# Altium schematic sheet RelèBluetooth.SchDoc
size A4; SheetNumber: 1; SheetTotal: 1
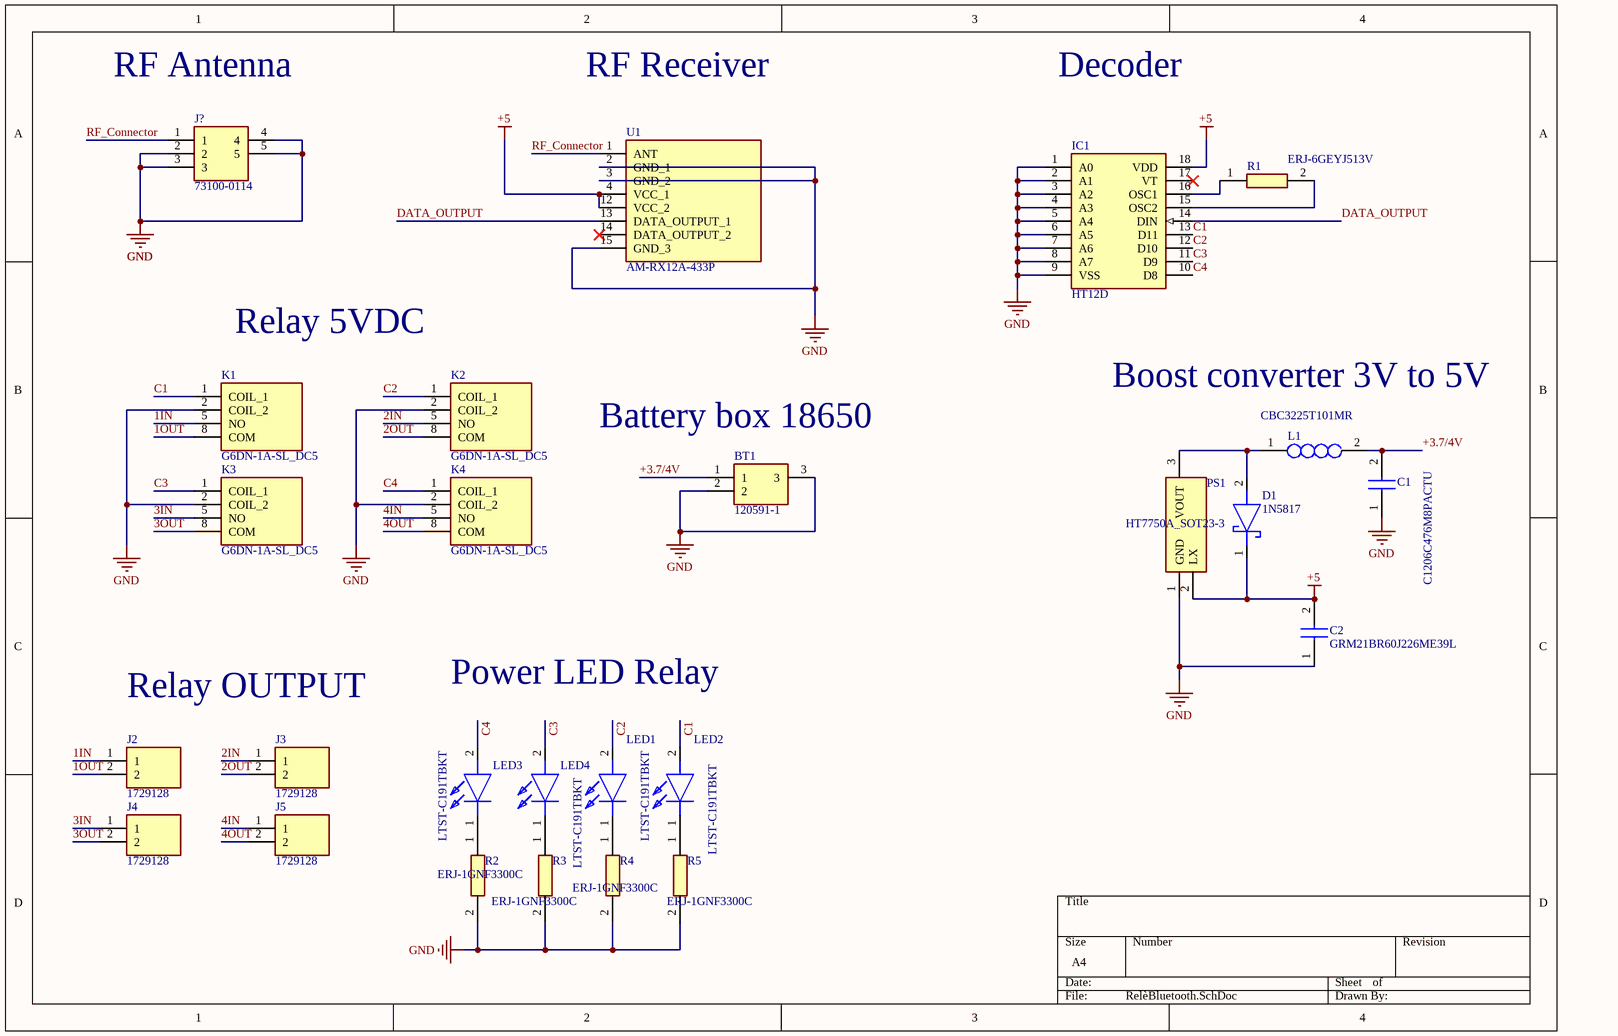
[diagram p0: RelèBluetooth.SchDoc]

## Parts
BT1  120591-1  [120591-1]
C1  C1206C476M8PACTU  [C1206]
C2  GRM21BR60J226ME39L  [CAPC2012X145N]
D1  1N5817  [DIOAD1410W90L470D235]
IC1  HT12D  [DIP794W56P254L2286H495Q18N]
J2  1729128  [1729128]
J3  1729128  [1729128]
J4  1729128  [1729128]
J5  1729128  [1729128]
J?  73100-0114  [731000114]
K1  G6DN-1A-SL_DC5  [G6DN1ASLDC5]
K2  G6DN-1A-SL_DC5  [G6DN1ASLDC5]
K3  G6DN-1A-SL_DC5  [G6DN1ASLDC5]
K4  G6DN-1A-SL_DC5  [G6DN1ASLDC5]
L1  CBC3225T101MR  [INDC3225X270N]
LED1  LTST-C191TBKT  [LEDC1608X65N]
LED2  LTST-C191TBKT  [LEDC1608X65N]
LED3  LTST-C191TBKT  [LEDC1608X65N]
LED4  LTST-C191TBKT  [LEDC1608X65N]
PS1  HT7750A_SOT23-3  [SOT95P190X145-3N]
R1  ERJ-6GEYJ513V  [RESC2012X70N]
R2  ERJ-1GNF3300C  [ERJ1GN_(0201)]
R3  ERJ-1GNF3300C  [ERJ1GN_(0201)]
R4  ERJ-1GNF3300C  [ERJ1GN_(0201)]
R5  ERJ-1GNF3300C  [ERJ1GN_(0201)]
U1  AM-RX12A-433P  [AMRX12A433P]

## Nets
+5: C2.2 D1.1(K) IC1.18(VDD) PS1.2(LX) U1.4(VCC_1) U1.12(VCC_2)
GND: BT1.2 BT1.3 C1.1 C2.1 IC1.1(A0) IC1.2(A1) IC1.3(A2) IC1.4(A3) IC1.5(A4) IC1.6(A5) IC1.7(A6) IC1.8(A7) IC1.9(VSS) J?.2 J?.3 J?.4 J?.5 K1.2(COIL_2) K2.2(COIL_2) K3.2(COIL_2) K4.2(COIL_2) PS1.1(GND) R2.2 R3.2 R4.2 R5.2 U1.2(GND_1) U1.3(GND_2) U1.15(GND_3)
1IN: J2.1 K1.5(NO)
1OUT: J2.2 K1.8(COM)
2IN: J3.1 K2.5(NO)
2OUT: J3.2 K2.8(COM)
3IN: J4.1 K3.5(NO)
3OUT: J4.2 K3.8(COM)
4IN: J5.1 K4.5(NO)
4OUT: J5.2 K4.8(COM)
+3.7/4V: BT1.1 C1.2 L1.2
C1: IC1.13(D11) K1.1(COIL_1) LED2.2(A)
C2: IC1.12(D10) K2.1(COIL_1) LED1.2(A)
C3: IC1.11(D9) K3.1(COIL_1) LED4.2(A)
C4: IC1.10(D8) K4.1(COIL_1) LED3.2(A)
DATA_OUTPUT: IC1.14(DIN) U1.13(DATA_OUTPUT_1)
RF_Connector: J?.1 U1.1(ANT)
NetD1_2: D1.2(A) L1.1 PS1.3(VOUT)
NetIC1_15: IC1.15(OSC2) R1.2
NetIC1_16: IC1.16(OSC1) R1.1
NetLED1_1: LED1.1(K) R4.1
NetLED2_1: LED2.1(K) R5.1
NetLED3_1: LED3.1(K) R2.1
NetLED4_1: LED4.1(K) R3.1

Not connected (* = marked no-connect by the designer): IC1 17(VT)*; U1 14(DATA_OUTPUT_2)*

## Notes on the sheet
- RF Antenna
- RF Receiver
- Decoder
- Relay 5VDC
- (near BT1) Battery box 18650
- Boost converter 3V to 5V
- Relay OUTPUT
- Power LED Relay

## Library data of the parts
BT1 = 120591-1: Battery; Manufacturer_Name: TE Connectivity; Datasheet Link: http://www.te.com/commerce/DocumentDelivery/DDEController?Action=srchrtrv&DocNm=120591&DocType=Customer+Drawing&DocLang=English&DocFormat=pdf&PartCntxt=120591-1; Manufacturer_Part_Number: 120591-1; Mouser Part Number: 571-1205911; Mouser Price/Stock: https://www.mouser.co.uk/ProductDetail/TE-Connectivity/120591-1?qs=cB%252BprIo57OeZ1n1mnEiYEw%3D%3D; Arrow Part Number: 120591-1; Arrow Price/Stock: https://www.arrow.com/en/products/120591-1/te-connectivity?region=nac
C1 = C1206C476M8PACTU: Capacitor; Manufacturer_Name: KEMET; Datasheet Link: https://content.kemet.com/datasheets/KEM_C1006_X5R_SMD.pdf; Manufacturer_Part_Number: C1206C476M8PACTU; Mouser Part Number: 80-C1206C476M8P; Mouser Price/Stock: https://www.mouser.co.uk/ProductDetail/KEMET/C1206C476M8PACTU?qs=K%2Fj%2Fqf%252B0fqIWQ8LQ8mLiKw%3D%3D; Arrow Part Number: C1206C476M8PACTU; Arrow Price/Stock: https://www.arrow.com/en/products/c1206c476m8pactu/kemet-corporation
C2 = GRM21BR60J226ME39L: Capacitor; Manufacturer_Name: Murata Electronics; Datasheet Link: http://www.murata.com/~/media/webrenewal/support/library/catalog/products/capacitor/mlcc/c02e.pdf; Height: 1.45mm; Manufacturer_Part_Number: GRM21BR60J226ME39L; Mouser Part Number: 81-GRM21R60J226ME39L; Mouser Price/Stock: https://www.mouser.co.uk/ProductDetail/Murata-Electronics/GRM21BR60J226ME39L?qs=DJY02EClX9n4vY1%2FNV53Qw%3D%3D; Arrow Part Number: GRM21BR60J226ME39L; Arrow Price/Stock: https://www.arrow.com/en/products/grm21br60j226me39l/murata-manufacturing?region=nac
D1 = 1N5817: Schottky Diode; Manufacturer_Name: Rectron; Datasheet Link: https://www.arrow.com/en/products/1n5817/rectron; Manufacturer_Part_Number: 1N5817; Arrow Part Number: 1N5817; Arrow Price/Stock: https://www.arrow.com/en/products/1n5817/rectron?region=nac
IC1 = HT12D: Integrated Circuit; Manufacturer_Name: Holtek; Datasheet Link: https://datasheet.datasheetarchive.com/originals/distributors/Datasheets-28/DSA-559636.pdf; Height: 4.953mm; Manufacturer_Part_Number: HT12D
J2-J5 = 1729128: Connector; Manufacturer_Name: Phoenix Contact; Datasheet Link: http://www.phoenixcontact.net/product/1729128; Height: 10.15mm; Manufacturer_Part_Number: 1729128; Mouser Part Number: 651-1729128; Mouser Price/Stock: https://www.mouser.co.uk/ProductDetail/Phoenix-Contact/1729128?qs=GFUSqQMLmmnCBVBY3dts9w%3D%3D; Arrow Part Number: 1729128; Arrow Price/Stock: https://www.arrow.com/en/products/1729128/phoenix-contact?region=nac
J? = 73100-0114: Connector; Manufacturer_Name: Molex; Datasheet Link: https://www.molex.com/pdm_docs/sd/731000114_sd.pdf; Height: 9.57mm; Manufacturer_Part_Number: 73100-0114; Mouser Part Number: 538-73100-0114; Mouser Price/Stock: https://www.mouser.co.uk/ProductDetail/Molex/73100-0114?qs=ohtcwxb5zIvxHEM9IPQ5cQ%3D%3D; Arrow Part Number: 73100-0114; Arrow Price/Stock: https://www.arrow.com/en/products/73100-0114/molex?region=nac
K1-K4 = G6DN-1A-SL_DC5: Relay or Contactor; Manufacturer_Name: Omron Electronics; Manufacturer_Part_Number: G6DN-1A-SL DC5; Datasheet Link: https://datasheet.lcsc.com/szlcsc/1909171832_Omron-Electronics-G6DN-1A-SL-DC5_C397208.pdf; Height: 12.5mm; Mouser Part Number: 653-G6DN-1A-SL-DC5; Mouser Price/Stock: https://www.mouser.co.uk/ProductDetail/Omron-Electronics/G6DN-1A-SL-DC5?qs=Cb2nCFKsA8rQaEt13kEruA%3D%3D; Arrow Part Number: G6DN-1A-SL DC5; Arrow Price/Stock: https://www.arrow.com/en/products/g6dn-1a-sl-dc5/omron?region=nac
L1 = CBC3225T101MR: Inductor; Manufacturer_Name: TAIYO YUDEN; Datasheet Link: https://componentsearchengine.com/Datasheets/2/CBC3225T101MR.pdf; Height: 2.7mm; Manufacturer_Part_Number: CBC3225T101MR; Mouser Part Number: 963-CBC3225T101MR; Mouser Price/Stock: https://www.mouser.co.uk/ProductDetail/TAIYO-YUDEN/CBC3225T101MR?qs=I6KAKw0tg2wCaeirMPJHXw%3D%3D; Arrow Part Number: CBC3225T101MR; Arrow Price/Stock: https://www.arrow.com/en/products/cbc3225t101mr/taiyo-yuden
LED1-LED4 = LTST-C191TBKT: LED; Manufacturer_Name: Lite-On; Datasheet Link: http://optoelectronics.liteon.com/upload/download/DS22-2000-230/LTST-C191TBKT.pdf; Height: 0.65mm; Manufacturer_Part_Number: LTST-C191TBKT; Mouser Part Number: 859-LTST-C191TBKT; Mouser Price/Stock: https://www.mouser.co.uk/ProductDetail/Lite-On/LTST-C191TBKT?qs=dmW16TmpDgF%252B6HWuTmCtcw%3D%3D; Arrow Part Number: LTST-C191TBKT; Arrow Price/Stock: https://www.arrow.com/en/products/ltst-c191tbkt/lite-on-technology?region=nac
PS1 = HT7750A_SOT23-3: Power Supply; Manufacturer_Name: Holtek; Manufacturer_Part_Number: HT7750A SOT23-3; Height: 1.45mm
R1 = ERJ-6GEYJ513V: Resistor; Manufacturer_Name: Panasonic; Datasheet Link: https://datasheet.datasheetarchive.com/originals/distributors/DKDS40/DSANUWW0011030.pdf; Height: 0.7mm; Manufacturer_Part_Number: ERJ-6GEYJ513V; Mouser Part Number: 667-ERJ-6GEYJ513V; Mouser Price/Stock: https://www.mouser.com/Search/Refine.aspx?Keyword=667-ERJ-6GEYJ513V; Arrow Part Number: ERJ-6GEYJ513V; Arrow Price/Stock: https://www.arrow.com/en/products/erj-6geyj513v/panasonic
R2-R5 = ERJ-1GNF3300C: Resistor; Manufacturer_Name: Panasonic; Datasheet Link: https://industrial.panasonic.com/cdbs/www-data/pdf/RDA0000/AOA0000C301.pdf; Height: 0.26mm; Manufacturer_Part_Number: ERJ-1GNF3300C; Mouser Part Number: 667-ERJ-1GNF3300C; Mouser Price/Stock: https://www.mouser.co.uk/ProductDetail/Panasonic/ERJ-1GNF3300C?qs=nuXzIS8loXGdtA3emz%252Bc%252Bg%3D%3D; Arrow Part Number: ERJ-1GNF3300C; Arrow Price/Stock: https://www.arrow.com/en/products/erj-1gnf3300c/panasonic
U1 = AM-RX12A-433P: Undefined or Miscellaneous; Manufacturer_Name: RF SOLUTIONS; Datasheet Link: https://datasheet.datasheetarchive.com/originals/distributors/DKDS-5/87927.pdf; Height: 14mm; Manufacturer_Part_Number: AM-RX12A-433P; Mouser Part Number: 223-AM-RX12A-433P; Mouser Price/Stock: https://www.mouser.co.uk/ProductDetail/RF-Solutions/AM-RX12A-433P?qs=OlC7AqGiEDnLHUSop2Y94Q%3D%3D; Arrow Part Number: AM-RX12A-433P; Arrow Price/Stock: https://www.arrow.com/en/products/am-rx12a-433p/rf-solutions